# EAGLE design PicoBoard (EAGLE 6.5.0)
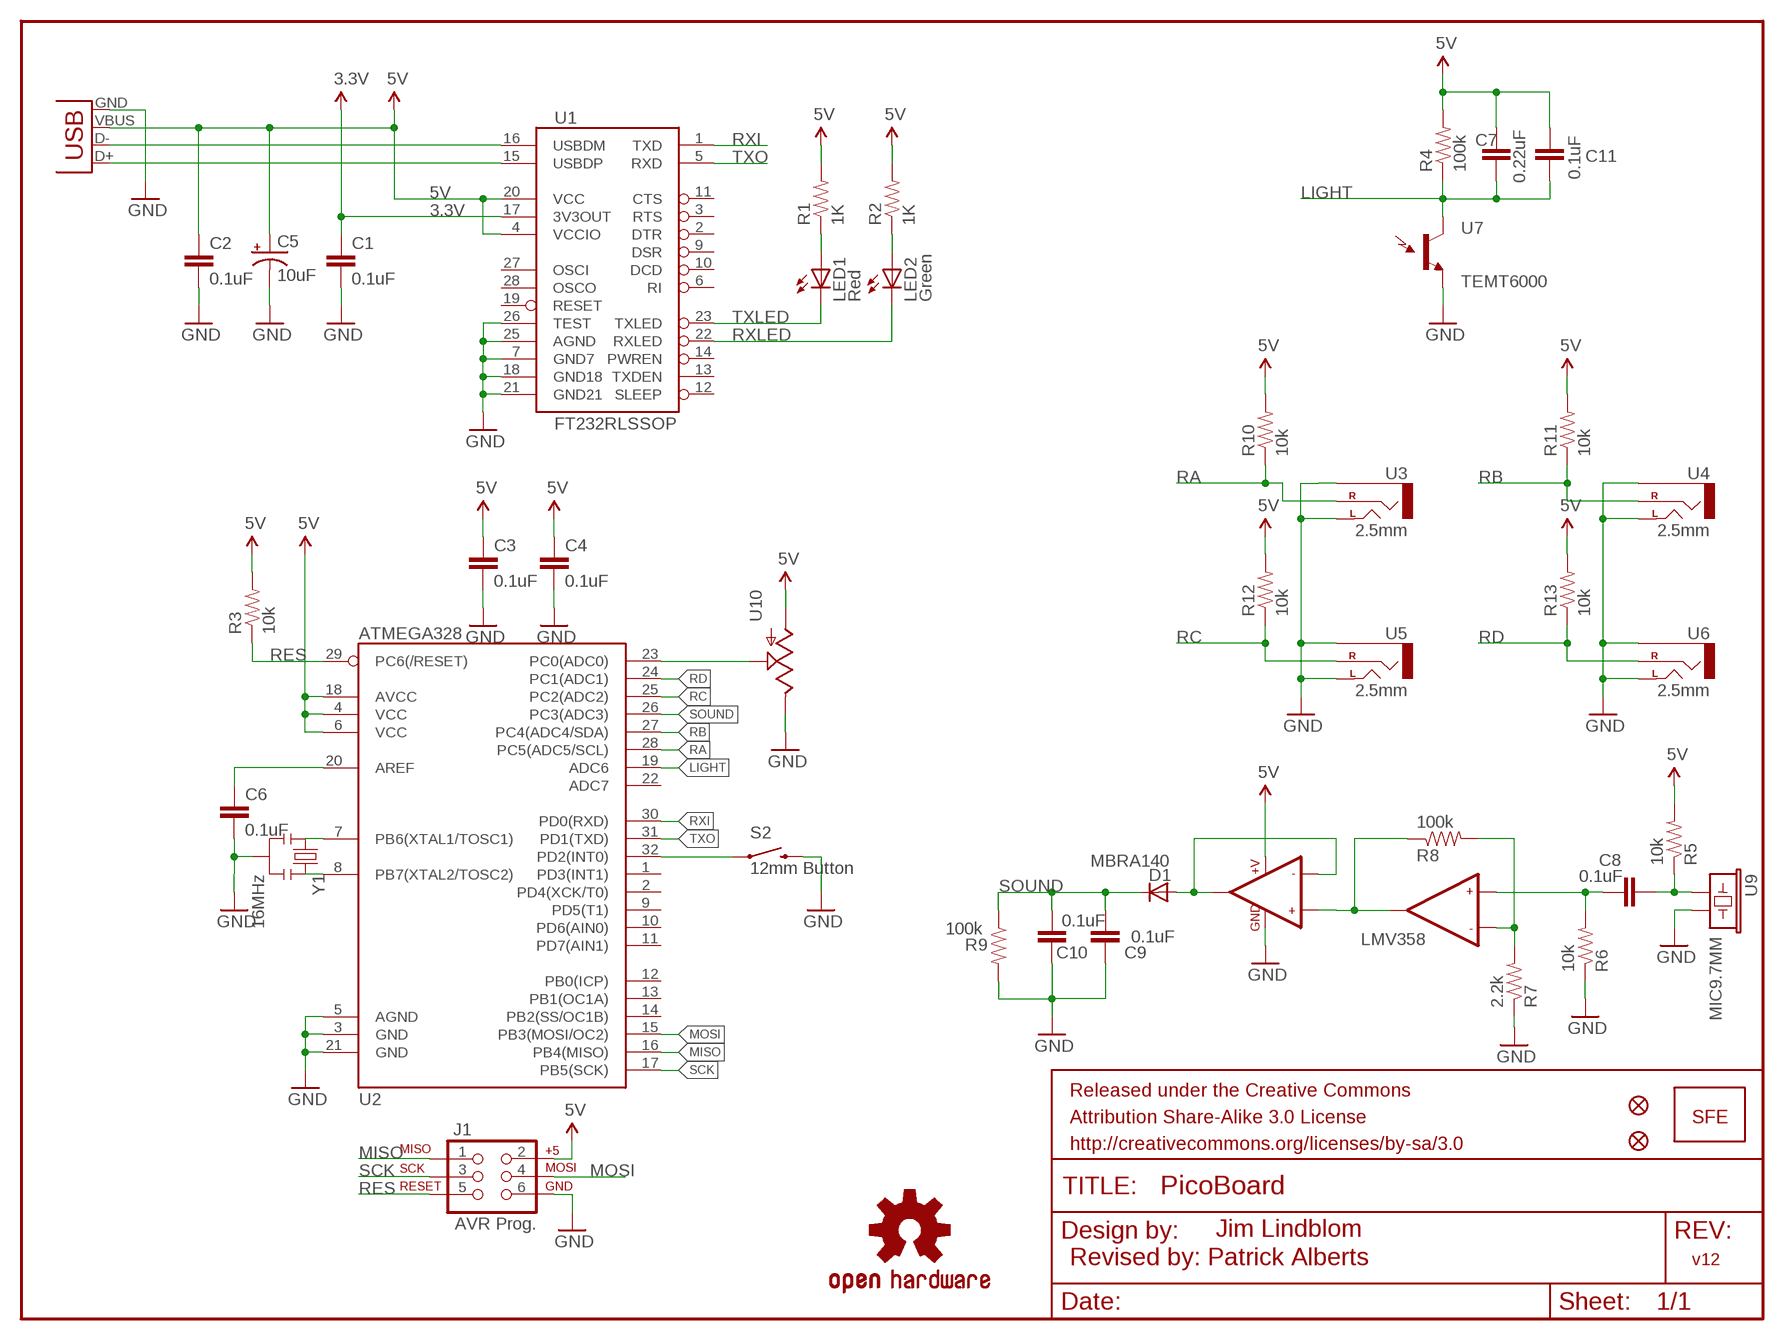
[diagram p0: schematic, sheet 1]

## Parts
C1  0.1uF  CAP0603-CAP  [0603-CAP]
C2  0.1uF  CAP0603-CAP  [0603-CAP]
C3  0.1uF  CAP0603-CAP  [0603-CAP]
C4  0.1uF  CAP0603-CAP  [0603-CAP]
C5  10uF  CAP_POL1206  [EIA3216]
C6  0.1uF  CAP0603-CAP  [0603-CAP]
C7  0.22uF  CAP0603-CAP  [0603-CAP]
C8  0.1uF  CAP0603-CAP  [0603-CAP]
C9  0.1uF  CAP0603-CAP  [0603-CAP]
C10  0.1uF  CAP0603-CAP  [0603-CAP]
C11  0.1uF  CAP0603-CAP  [0603-CAP]
D1  MBRA140  DIODESMA  [SMA-DIODE]
FID1  FIDUCIAL1X2  [FIDUCIAL-1X2]
FID2  FIDUCIAL1X2  [FIDUCIAL-1X2]
FRAME1  FRAME-LETTER  [CREATIVE_COMMONS]
J1  AVR Prog.  AVR_SPI_PRG_6PTH  [2X3]
JP1  LOGO-SFENEW  [SFE-NEW-WEBLOGO]
LED1  Red  LED0603  [LED-0603]
LED2  Green  LED0603  [LED-0603]
LOGO1  OSHW-LOGOL  [OSHW-LOGO-L]
R1  1K  RESISTOR0603-RES  [0603-RES]
R2  1K  RESISTOR0603-RES  [0603-RES]
R3  10k  RESISTOR0603-RES  [0603-RES]
R4  100k  RESISTOR0603-RES  [0603-RES]
R5  10k  RESISTOR0603-RES  [0603-RES]
R6  10k  RESISTOR0603-RES  [0603-RES]
R7  2.2k  RESISTOR0603-RES  [0603-RES]
R8  100k  RESISTOR0603-RES  [0603-RES]
R9  100k  RESISTOR0603-RES  [0603-RES]
R10  10k  RESISTOR0603-RES  [0603-RES]
R11  10k  RESISTOR0603-RES  [0603-RES]
R12  10k  RESISTOR0603-RES  [0603-RES]
R13  10k  RESISTOR0603-RES  [0603-RES]
S2  12mm Button  SWITCH-MOMENTARY-2SMD-12MM  [TACTILE-SMD-12MM]
U1  FT232RLSSOP  [SSOP28DB]
U2  ATMEGA328  ATMEGA168  [TQFP32-08]
U3  2.5mm  AUDIO-JACK1:1  [STEREOJACK2.5MM]
U4  2.5mm  AUDIO-JACK1:1  [STEREOJACK2.5MM]
U5  2.5mm  AUDIO-JACK1:1  [STEREOJACK2.5MM]
U6  2.5mm  AUDIO-JACK1:1  [STEREOJACK2.5MM]
U7  TEMT6000  [TEMT6000-SEN]
U8  LMV358  [SO08]
U9  MIC9.7MM  [MIC-9.7MM]
U10  SLIDER60MM  [SLIDER]
X1  USBSMD  [USB-MINIB]
Y1  16MHz  RESONATORSMD  [RESONATOR-SMD]

## Nets
3.3V [power]: C1.1 U1.17(3V3OUT)
5V: C2.1 C3.1 C4.1 C5.A(+) C7.1 C11.1 J1.2 R1.2 R2.2 R3.2 R4.2 R5.2 R10.2 R11.2 R12.2 R13.2 U1.4(VCCIO) U1.20(VCC) U2.4(VCC) U2.6(VCC) U2.18(AVCC) U8.8(+V) U10.3(A) X1.VBUS
GND [power]: C1.2 C2.2 C3.2 C4.2 C5.C(-) C6.2 C9.1 C10.1 J1.6 R6.1 R7.1 R9.2 S2.3 U1.7(GND7) U1.18(GND18) U1.21(GND21) U1.25(AGND) U1.26(TEST) U2.3(GND) U2.5(AGND) U2.21(GND) U3.1(LEFT) U3.5(SLEEVE) U4.1(LEFT) U4.5(SLEEVE) U5.1(LEFT) U5.5(SLEEVE) U6.1(LEFT) U6.5(SLEEVE) U7.EMITTER(E1) U8.4(GND) U9.2 U10.1(E) X1.GND Y1.2
LIGHT: C7.2 C11.2 R4.1 U2.19(ADC6) U7.COLLECTOR(C1)
MISO: J1.1 U2.16(PB4(MISO))
MOSI: J1.4 U2.15(PB3(MOSI/OC2))
N$1: LED1.A R1.1
N$2: LED2.A R2.1
N$3: R7.2 R8.2 U8.6(-IN2)
N$5: U2.7(PB6(XTAL1/TOSC1)) Y1.1
N$6: U2.8(PB7(XTAL2/TOSC2)) Y1.3
N$7: C6.1 U2.20(AREF)
N$8: S2.1 U2.32(PD2(INT0))
N$9: C8.1 R5.1 U9.1
N$10: U2.23(PC0(ADC0)) U10.2A(S)
N$11: C8.2 R6.2 U8.5(+IN2)
N$13: D1.A U8.1(OUT1) U8.2(-IN1)
N$16: R8.1 U8.3(+IN1) U8.7(OUT2)
RA: R10.1 U2.28(PC5(ADC5/SCL)) U3.4(RIGHT)
RB: R11.1 U2.27(PC4(ADC4/SDA)) U4.4(RIGHT)
RC: R12.1 U2.25(PC2(ADC2)) U5.4(RIGHT)
RD: R13.1 U2.24(PC1(ADC1)) U6.4(RIGHT)
RES: J1.5 R3.1 U2.29(PC6(/RESET))
RXI: U1.1(TXD) U2.30(PD0(RXD))
RXLED: LED2.C U1.22(RXLED)
SCK: J1.3 U2.17(PB5(SCK))
SOUND: C9.2 C10.2 D1.C R9.1 U2.26(PC3(ADC3))
TXLED: LED1.C U1.23(TXLED)
TXO: U1.5(RXD) U2.31(PD1(TXD))
USB_D+: U1.15(USBDP) X1.D+
USB_D-: U1.16(USBDM) X1.D-
Unconnected: U1.2(DTR) U1.3(RTS) U1.6(RI) U1.9(DSR) U1.10(DCD) U1.11(CTS) U1.12(SLEEP) U1.13(TXDEN) U1.14(PWREN) U1.19(RESET) U1.27(OSCI) U1.28(OSCO) U2.1(PD3(INT1)) U2.2(PD4(XCK/T0)) U2.9(PD5(T1)) U2.10(PD6(AIN0)) U2.11(PD7(AIN1)) U2.12(PB0(ICP)) U2.13(PB1(OC1A)) U2.14(PB2(SS/OC1B)) U2.22(ADC7)

## Notes on the sheet
- LMV358
- Jim Lindblom
- Revised by: Patrick Alberts | v12

## Library data of the parts
C1-C4 C6-C11 = SparkFun:CAP: Capacitor Standard 0603 ceramic capacitor, and 0.1" leaded capacitor.
C5 = SparkFun:CAP_POL: Capacitor Polarized These are standard SMD and PTH capacitors. Normally 10uF, 47uF, and 100uF in electrolytic and tantalum varieties. Always verify the external diameter of the through hole cap, it varies with capacity, voltage, and manufacturer. The EIA devices should be standard.
D1 = SparkFun:DIODE: Diode These are standard reverse protection diodes and small signal diodes. SMA package can handle up to about 1A. SOD-323 can handle about 200mA. What the SOD-323 package when ordering, there are some mfgs out there that are 5-pin packages.
FID1 FID2 = SparkFun-Aesthetics:FIDUCIAL: Fiducial Alignment Points Various fiducial points for machine vision alignment.
FRAME1 = SparkFun-Aesthetics:FRAME-LETTER: Schematic Frame Standard 8.5x11 US Letter frame
J1 = SparkFun:AVR_SPI_PRG_6: AVR ISP 6 Pin This is the reduced ISP connector for AVR programming. Common on Arduino. This footprint will take up less PCB space and can be used with a 10-pin to 6-pin adapter such as SKU: BOB-08508
JP1 = SparkFun:LOGO-SFE: Spark Fun Electronics PCB Logo This is the standard Spark Fun Electronics PCB logo.
LED1 LED2 = SparkFun:LED: LEDs Standard schematic elements and footprints for 5mm, 3mm, 1206, and 0603 sized LEDs. 5mm - Spark Fun Electronics SKU : COM-00529 (and others)
LOGO1 = SparkFun-Aesthetics:OSHW-LOGO: Open Source Hardware Logo This logo indicates the piece of hardware it is found on incorporates a OSHW license and/or adheres to the definition of open source hardware found here: http://freedomdefined.org/OSHW
R1-R13 = SparkFun:RESISTOR: Resistor Basic schematic elements and footprints for 0603, 1206, and PTH resistors.
S2 = SparkFun-Electromechanical:SWITCH-MOMENTARY-2: Various NO switches- pushbuttons, reed, etc
U1 = SparkFun:FT232RL: USB UART FT232RL 4th Generation USB UART (USB <-> Serial) Controller. Spark Fun Electronics SKU : COM-00650
U2 = SparkFun:ATMEGA168
U3-U6 = SparkFun-Connectors:AUDIO-JACK: 3.5mm Audio Jack Simple 3.5mm common PCB mount audio jack. SKU: PRT-08032
U7 = SparkFun:TEMT6000: Ambient Light Sensor Simple light detection sensor. Output varies with light intensity input. Spark Fun Electronics SKU : COM-08348
U8 = SparkFun:LMV358
U9 = SparkFun:MIC: Microphone Omni-directional electret microphone. 9.7mm standard diameter.
U10 = SparkFun-Electromechanical:SLIDER: Slide-type potentiometers. Small and meduim footprints untested.; PROD_ID: RES-09484
X1 = SparkFun:USB: USB Connectors USB-B-PTH is fully proven SKU : PRT-00139 USB-miniB is fully proven SKU : PRT-00587 USB-A-PCB is untested. USB-A-H is throughly reviewed, but untested. Spark Fun Electronics SKU : PRT-00437 USB-B-SMT is throughly reviewed, but untested. Needs silkscreen touching up. USB-A-S has not been used/tested USB-MB-H has not been used/tested
Y1 = SparkFun:RESONATOR: Resonator Small SMD resonator. This is the itty bitty 10/20MHz resonators with built in caps. CSTCE10M0G55 and CSTCE20M0V53. Footprint has been reviewed closely but hasn't been tested yet.

## Net classes
0 default: width 0.203 mm
1 power: width 0.254 mm

## Board
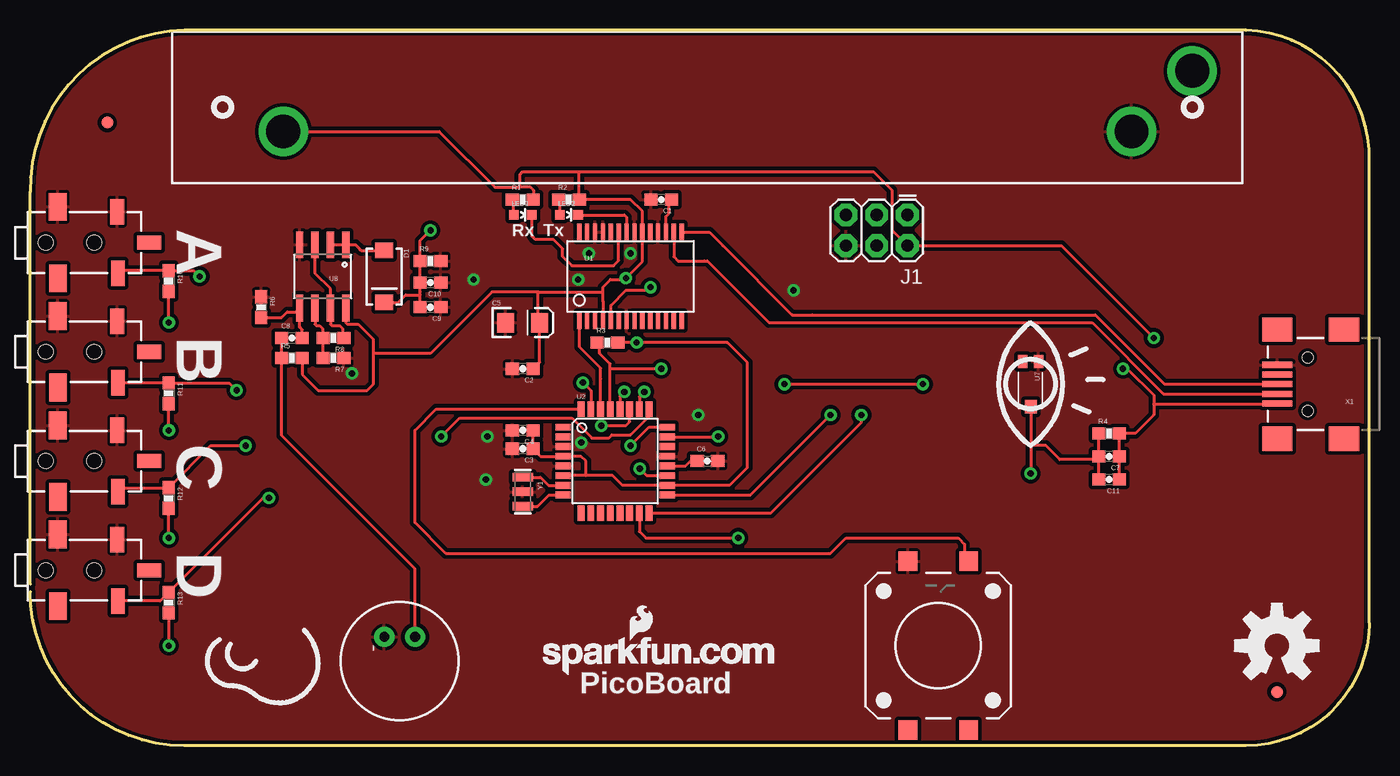
[diagram p1: board, top side]
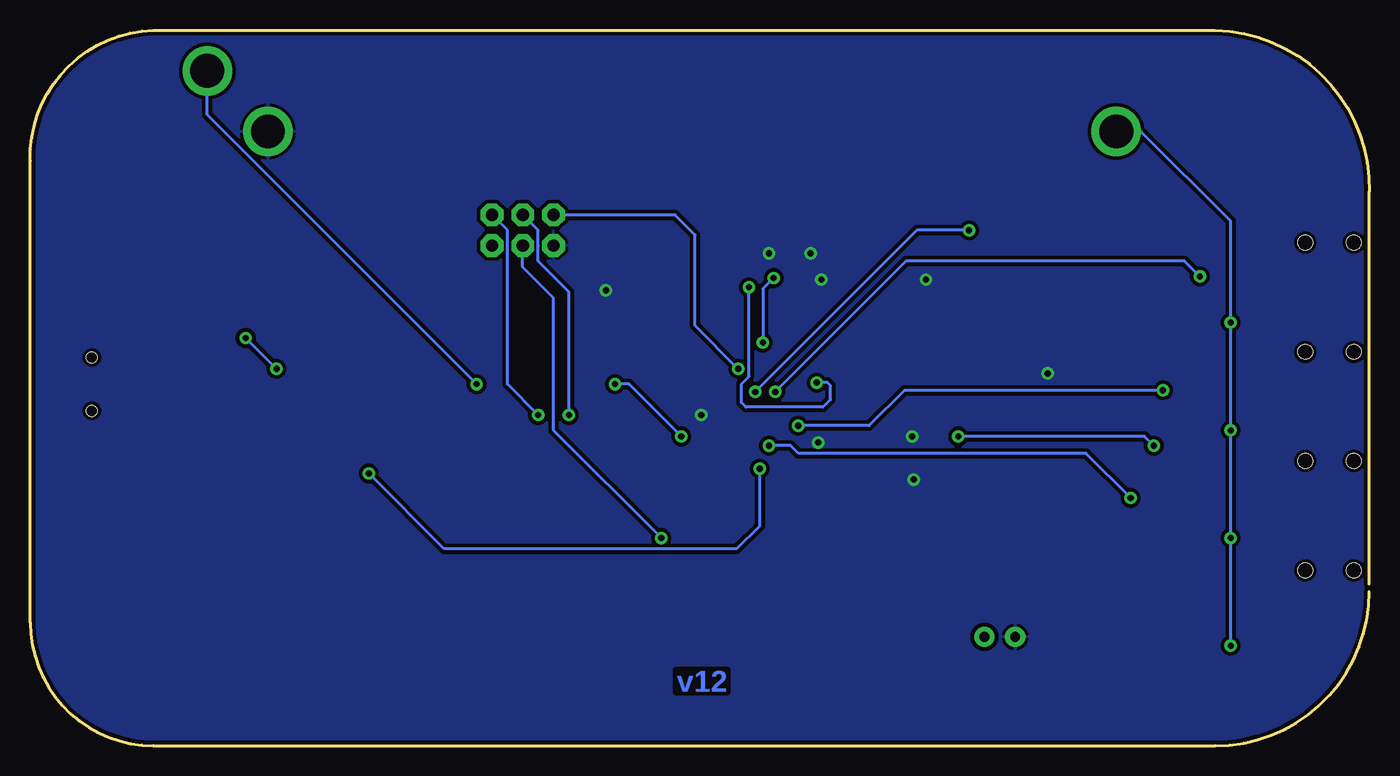
[diagram p2: board, bottom side, seen from below]

Size 110.49 x 59.05 mm. Coordinates in mm from the lower left corner, seen from the top.
Outline: 0,12.7 arc90 12.7,0 100.33,0 arc90 110.49,10.16 110.49,48.26 arc90 100.33,59.05 12.7,59.05 arc90 0,45.72 0,13.34
Copper layers (1*16): Top 0.035mm / dielectric 1.5mm / Bottom 0.035mm
Design rules "SparkFun *": minimum track width 7mil, minimum drill 15mil, track to track 8mil, track to pad 8mil, pad to pad 8mil, via to via 8mil, smd to smd 8mil, copper to edge 8mil, drill to drill 8mil, minimum pad ring 12mil, minimum via ring 10mil, stop-mask expansion 4mil, vias tented up to drill 20mil, thermal gap 10mil

### Footprints (pad centres in the part's own frame; a part is rotated, then mirrored left to right if it is on the bottom)
0603-CAP = smd 1.1 x 1: 1 -0.85,0; 2 0.85,0
EIA3216 = smd 1.4 x 1.6: A 1.4,0; C -1.4,0
SMA-DIODE = smd 1.27 x 1.47: A -2.15,0; C 2.15,0
FIDUCIAL-1X2 = smd 1 x 1: 1 0,0
2X3 = drill 1.016 pad 1.88 octagon: 1 0,0; 2 0,2.54; 3 2.54,0; 4 2.54,2.54; 5 5.08,0; 6 5.08,2.54
LED-0603 = smd 0.8 x 0.8: A 0,-0.75; C 0,0.75
0603-RES = smd 1.1 x 1: 1 -0.85,0; 2 0.85,0
TACTILE-SMD-12MM = smd 1.6 x 1.55: 1 6.975,-2.5; 2 -6.975,-2.5; 3 6.975,2.5; 4 -6.975,2.5
SSOP28DB = smd 0.348 x 1.397: 1 -4.225,-3.656; 2 -3.575,-3.656; 3 -2.925,-3.656; 4 -2.275,-3.656; 5 -1.625,-3.656; 6 -0.975,-3.656; 7 -0.325,-3.656; 8 0.325,-3.656; 9 0.975,-3.656; 10 1.625,-3.656; 11 2.275,-3.656; 12 2.925,-3.656; 13 3.575,-3.656; 14 4.225,-3.656; 15 4.225,3.656; 16 3.575,3.656; 17 2.925,3.656; 18 2.275,3.656; 19 1.625,3.656; 20 0.975,3.656; 21 0.325,3.656; 22 -0.325,3.656; 23 -0.975,3.656; 24 -1.625,3.656; 25 -2.275,3.656; 26 -2.925,3.656; 27 -3.575,3.656; 28 -4.225,3.656
TQFP32-08 = smd 1.27 x 0.559: 1 -4.293,2.8; 2 -4.293,2; 3 -4.293,1.2; 4 -4.293,0.4; 5 -4.293,-0.4; 6 -4.293,-1.2; 7 -4.293,-2; 8 -4.293,-2.8; 17 4.293,-2.8; 18 4.293,-2; 19 4.293,-1.2; 20 4.293,-0.4; 21 4.293,0.4; 22 4.293,1.2; 23 4.293,2; 24 4.293,2.8 | smd 0.559 x 1.27: 9 -2.8,-4.293; 10 -2,-4.293; 11 -1.2,-4.293; 12 -0.4,-4.293; 13 0.4,-4.293; 14 1.2,-4.293; 15 2,-4.293; 16 2.8,-4.293; 25 2.8,4.293; 26 2,4.293; 27 1.2,4.293; 28 0.4,4.293; 29 -0.4,4.293; 30 -1.2,4.293; 31 -2,4.293; 32 -2.8,4.293
STEREOJACK2.5MM = smd 1.144 x 2.1: 1 5.898,2.54 | smd 1.998 x 1.17: 3 8.55,0 | smd 1.119 x 2.1: 4 5.949,-2.54 | smd 1.467 x 2.3: 5 1,2.952; A 1.016,-2.952 | hole 1.2: 0,0; 4,0
TEMT6000-SEN = smd 1.1 x 0.8: BASE -1.87,-0.65; EMITTER -1.87,0.65 | smd 1.1 x 1: COLLECTOR 1.86,0.01
SO08 = smd 0.61 x 2.21: 1 -1.905,-2.616; 2 -0.635,-2.616; 3 0.635,-2.616; 4 1.905,-2.616; 5 1.905,2.616; 6 0.635,2.616; 7 -0.635,2.616; 8 -1.905,2.616
MIC-9.7MM = drill 0.8 pad 1.676: 1 -2,1.27; 2 -2,-1.27
SLIDER = drill 2.8 pad 4.064: 1 -35,2; 2A -40,-3; 3 35,2
USB-MINIB = smd 2.5 x 0.5: D+ 2.5,0; D- 2.5,0.8; GND 2.5,-1.6; ID 2.5,-0.8; VBUS 2.5,1.6 | smd 2.5 x 2: MTN1 -3,4.5; MTN2 2.5,4.5; MTN3 -3,-4.5; MTN4 2.5,-4.5 | hole 0.9: 0,2.2; 0,-2.2
RESONATOR-SMD = smd 0.7 x 1.7: 1 -1.2,0; 2 0,0; 3 1.2,0

### Placement (x,y rotation side)
C1  52.07,45.09 180 top
C2  40.64,31.11 180 top
C3  40.64,24.51 180 top
C4  40.64,26.04 180 top
C5  40.64,34.93 0 top
C6  55.88,23.49 0 top
C7  89.03,23.88 180 top
C8  21.59,33.66 0 top
C9  33.02,36.2 180 top
C10  33.02,38.23 180 top
C11  89.03,21.97 180 top
D1  29.21,38.73 270 top
FID1  6.35,51.44 0 top
FID2  102.87,4.45 0 top
FRAME1  20.32,-8.26 0 top  (outside the outline)
J1  72.39,43.82 180 top
JP1  42.29,5.84 0 top
LED1  40.64,43.82 270 top
LED2  44.45,43.82 270 top
LOGO1  102.87,8.26 0 top
R1  40.64,45.09 0 top
R2  44.45,45.09 0 top
R3  47.62,33.27 0 top
R4  89.03,25.78 0 top
R5  21.59,32 0 top
R6  19.05,36.2 270 top
R7  25.02,32 180 top
R8  25.02,33.66 180 top
R9  33.02,40.01 0 top
R10  11.43,38.35 270 top
R11  11.43,29.08 270 top
R12  11.43,20.45 270 top
R13  11.43,11.81 270 top
S2  74.93,8.26 90 top
U1  49.53,38.73 0 top
U2  48.26,23.49 0 top
U3  1.27,41.53 0 top
U4  1.27,32.51 0 top
U5  1.27,23.49 0 top
U6  1.27,14.48 0 top
U7  82.55,29.84 270 top
U8  24.13,38.73 180 top
U9  30.48,6.99 270 top
U10  55.88,52.71 180 top
X1  105.41,29.84 180 top
Y1  40.64,20.95 270 top

### Tracks (layer width: path | path; a pad name or v marks a point on that pad's centre or on a via)
3.3V
  Top 0.254: U1.17 52.45,43.69 52.7,43.94 52.7,45.09 C1.1
5V  (via drill 0.51)
  Top 0.254: 45.85,22.29 48.06,22.29 48.86,21.49 U2.18 57.69,21.49 59.18,22.99 59.18,31.62 57.53,33.27 v50.04,33.27 R3.2 | 45.85,22.29 U2.6 | U1.4 47.26,36.69 47.24,36.7 47.24,37.47 | v11.43,34.93 R10.2 | v11.43,26.04 R11.2 | v11.43,17.14 R12.2 | R13.2 v11.43,8.26 | U10.3 33.75,50.71 38.35,46.1 40.39,46.1 | 45.3,47.37 40.64,47.37 40.39,47.12 40.39,46.1 | 45.3,47.37 69.6,47.37 71.12,45.85 71.12,42.55 J1.2 85.09,41.27 v92.71,33.66 | 45.85,22.29 45.85,23.49 45.45,23.89 U2.4 42.11,23.89 C3.1 C4.1 | C11.1 C7.1 R4.2 | R5.2 22.44,30.65 23.75,29.34 27.81,29.34 28.32,29.84 28.32,32.39 | 28.32,32.39 28.32,33.53 27.05,34.8 26.16,34.8 26.04,34.93 U8.8 | 47.24,37.47 47.24,37.85 47.88,38.48 49.02,38.48 v49.15,38.61 50.51,39.96 U1.20 50.51,44.11 49.53,45.09 R2.2 45.3,47.37 | v90.17,31.11 90.55,31.11 92.71,28.96 92.71,28.19 | R4.2 arc90 89.95,25.7 89.95,25.94 | 40.39,46.1 41.27,46.1 41.53,45.85 41.53,45.12 R1.2 | 92.71,28.19 102.86,28.19 X1.VBUS | 92.71,28.19 92.71,27.3 91.19,25.78 R4.2 | 41.91,37.47 47.24,37.47 | 41.91,37.47 41.91,35.05 C5.A 42.04,31.66 C2.1 | 41.91,37.47 38.1,37.47 33.02,32.39 28.32,32.39
  Bottom 0.254: U10.3 18.83,50.71 11.43,43.31 v11.43,34.93 v11.43,26.04 v11.43,17.14 v11.43,8.26 | v92.71,33.66 v90.17,31.11 | v49.15,38.61 50.04,37.72 v50.04,33.27
GND  (via drill 0.51)
  other vias: 26.54,30.73 45.47,25.02 55.12,27.3 62.99,37.59 36.58,38.48 37.72,25.53 37.59,21.97 46.1,40.64 45.21,38.48 49.53,40.64
  pour Top (isolate 0.305): 110.49,59.05 110.49,-0.64 0,-0.64 0,59.05
  pour Bottom (isolate 0.305): 110.49,59.05 110.49,-0.64 0,-0.64 0,59.05
LIGHT  (via drill 0.51)
  Top 0.254: U2.19 50.86,22.29 v50.29,22.86 | C11.2 C7.2 | C7.2 R4.1 | C7.2 87.92,23.62 84.96,23.62 83.82,24.76 82.56,24.76 | U7.COLLECTOR 82.56,24.76 | 82.56,24.76 82.56,22.49 v82.55,22.48
  Bottom 0.254: v50.29,22.86 50.29,18.16 52.2,16.26 76.33,16.26 v82.55,22.48
MISO  (via drill 0.51)
  Top 0.254: U2.16 61.11,19.2 61.98,20.07 62.1,20.19 67.94,26.04 68.58,26.67 v68.58,27.3
  Bottom 0.254: v68.58,27.3 71.12,29.84 71.12,38.73 71.12,42.55 J1.1
MOSI  (via drill 0.51)
  Top 0.254: U2.15 50.26,17.68 50.8,17.14 v58.42,17.14
  Bottom 0.254: J1.4 69.85,39.5 67.31,36.96 67.31,26.04 v58.42,17.14
N$1
  Top 0.254: LED1.A 39.89,45.09 R1.1
N$2
  Top 0.254: LED2.A 43.7,45.09 R2.1
N$3
  Top 0.254: R7.2 R8.2 24.13,33.69 24.13,34.42 23.88,34.67 23.62,34.67 23.5,34.8 U8.6
N$5
  Top 0.254: U2.7 42.77,21.49 42.16,22.1 42.11,22.15 Y1.1
N$6
  Top 0.254: U2.8 42.79,20.69 41.91,19.81 41.85,19.75 Y1.3
N$7
  Top 0.254: C6.1 54.48,23.49 54.23,23.24 54.08,23.09 U2.20
N$8
  Top 0.254: U2.32 33.5,27.79 31.75,26.04 31.75,18.41 34.29,15.88 66.04,15.88 67.31,17.14 76.58,17.14 77.09,16.64 77.09,15.57 S2.1 77.43,14.56 77.47,14.61
N$9
  Top 0.254: U9.1 31.75,14.61 20.74,25.61 R5.1 C8.1
N$10  (via drill 0.51)
  Top 0.254: U2.23 56.74,25.49 v56.77,25.53 | v62.23,29.84 v73.66,29.84
  Bottom 0.254: v56.77,25.53 61.09,29.84 v62.23,29.84 | U10.2A 95.89,55.63 95.89,52.07 v73.66,29.84
N$11
  Top 0.254: R6.2 20.74,35.34 21.21,35.81 21.92,35.81 U8.5 22.23,34.54 22.44,34.33 C8.2
N$13
  Top 0.254: D1.A 27.31,40.89 27.05,41.15 26.92,41.27 26.85,41.35 U8.1 24.94,41.35 24.89,41.4 24.84,41.35 U8.2
N$16
  Top 0.254: U8.3 23.5,38.99 24.77,37.72 U8.7 24.77,34.8 24.89,34.67 25.53,34.67 25.78,34.42 25.78,33.74 R8.1
RA  (via drill 0.51)
  Top 0.254: U2.28 48.66,28.85 v49.02,29.21 | v13.97,38.73 13.5,39.2 R10.1 7.43,39.2 U3.4
  Bottom 0.254: v49.02,29.21 38.23,40.01 15.24,40.01 v13.97,38.73
RB  (via drill 0.51)
  Top 0.254: U2.27 49.46,26.73 49.15,26.42 v47.12,26.42 | 7.53,30.13 7.49,30.1 7.46,30.13 7.38,30.13 U4.4 7.26,29.93 R11.1 16.42,29.93 v17.02,29.34
  Bottom 0.254: v47.12,26.42 41.27,26.42 38.35,29.34 v17.02,29.34
RC  (via drill 0.51)
  Top 0.254: U2.25 51.06,27.18 49.53,25.65 48.01,25.65 47.75,25.4 46.35,25.4 44.7,27.05 35.43,27.05 v33.91,25.53 | 7.58,21.24 7.62,21.21 7.66,21.24 | v17.78,24.76 14.9,24.76 R12.1 11.38,21.24 7.58,21.24 | 7.58,21.24 7.51,21.24 U5.4
  Bottom 0.254: v33.91,25.53 18.54,25.53 v17.78,24.76
RD  (via drill 0.51)
  Top 0.254: U2.24 51.06,26.29 v49.53,24.76 | 7.28,12.36 7.22,12.3 U6.4 10.71,11.94 R13.1 19.22,20.45 v19.68,20.45
  Bottom 0.254: v49.53,24.76 47.75,24.76 47.12,24.13 23.37,24.13 v19.68,20.45
RES  (via drill 0.51)
  Top 0.254: U2.29 47.86,31.11 | 47.86,31.11 47.86,31.51 46.99,32.39 46.99,33.06 R3.1 | v52.07,31.11 47.86,31.11
  Bottom 0.254: v52.07,31.11 55.63,34.67 55.63,42.16 57.28,43.82 J1.5
RXI
  Top 0.254: U2.30 47.06,30.3 47.06,31.17 46.99,31.24 45.3,32.93 U1.1
RXLED
  Top 0.254: LED2.C 49.02,43.82 49.2,43.63 U1.22
SCK  (via drill 0.51)
  Top 0.254: U2.17 59.43,20.69 59.69,20.95 v66.04,27.3
  Bottom 0.254: J1.3 68.58,42.55 68.58,41.27 68.58,40.01 66.04,37.47 v66.04,27.3
SOUND  (via drill 0.51)
  Top 0.254: U2.26 50.26,28.8 v50.67,29.21 | D1.C 30.36,36.59 30.99,37.21 32.17,37.21 | v33.02,42.55 32.17,41.7 R9.1 C10.2 32.17,37.47 32.17,37.21 | C9.2 32.17,37.21
  Bottom 0.254: v50.67,29.21 37.34,42.55 v33.02,42.55
TXLED
  Top 0.254: LED1.C 41.39,42.05 41.66,41.78 43.18,41.78 43.94,41.02 43.94,40.39 44.7,39.62 48.13,39.62 48.55,40.05 U1.23
TXO  (via drill 0.51)
  Top 0.254: U2.31 46.26,29.3 v45.59,29.97 | U1.5 47.91,36.35 49.15,37.59 50.93,37.59 v51.18,37.85
  Bottom 0.254: v45.59,29.97 44.7,29.97 44.45,29.72 44.45,28.57 45.09,27.94 51.44,27.94 51.82,28.32 51.82,29.84 51.18,30.48 v51.18,37.85
USB_D+
  Top 0.254: U1.15 56.03,42.39 57.15,41.27 62.87,35.56 64.52,35.56 87.88,35.56 91.69,31.75 91.95,31.5 93.6,29.84 X1.D+
USB_D-
  Top 0.254: U1.16 53.1,40.37 53.47,40.01 55.63,40.01 55.88,40.01 60.96,34.93 87.63,34.93 93.51,29.04 X1.D-

### Text on the board
Bottom: v12
tPlace: A | Rx | Tx | B | C | D | PicoBoard
tDocu: Jim Linblom | Revised by: Patrick Alberts